# EasyEDA schematic SCH_5730 Compact_2022-07-11.json
TITLE: Sheet_1; REV: 1.0; Date: 2022-07-10; Sheet: 1/1; Drawn By: limchengwei; Company: Your Company
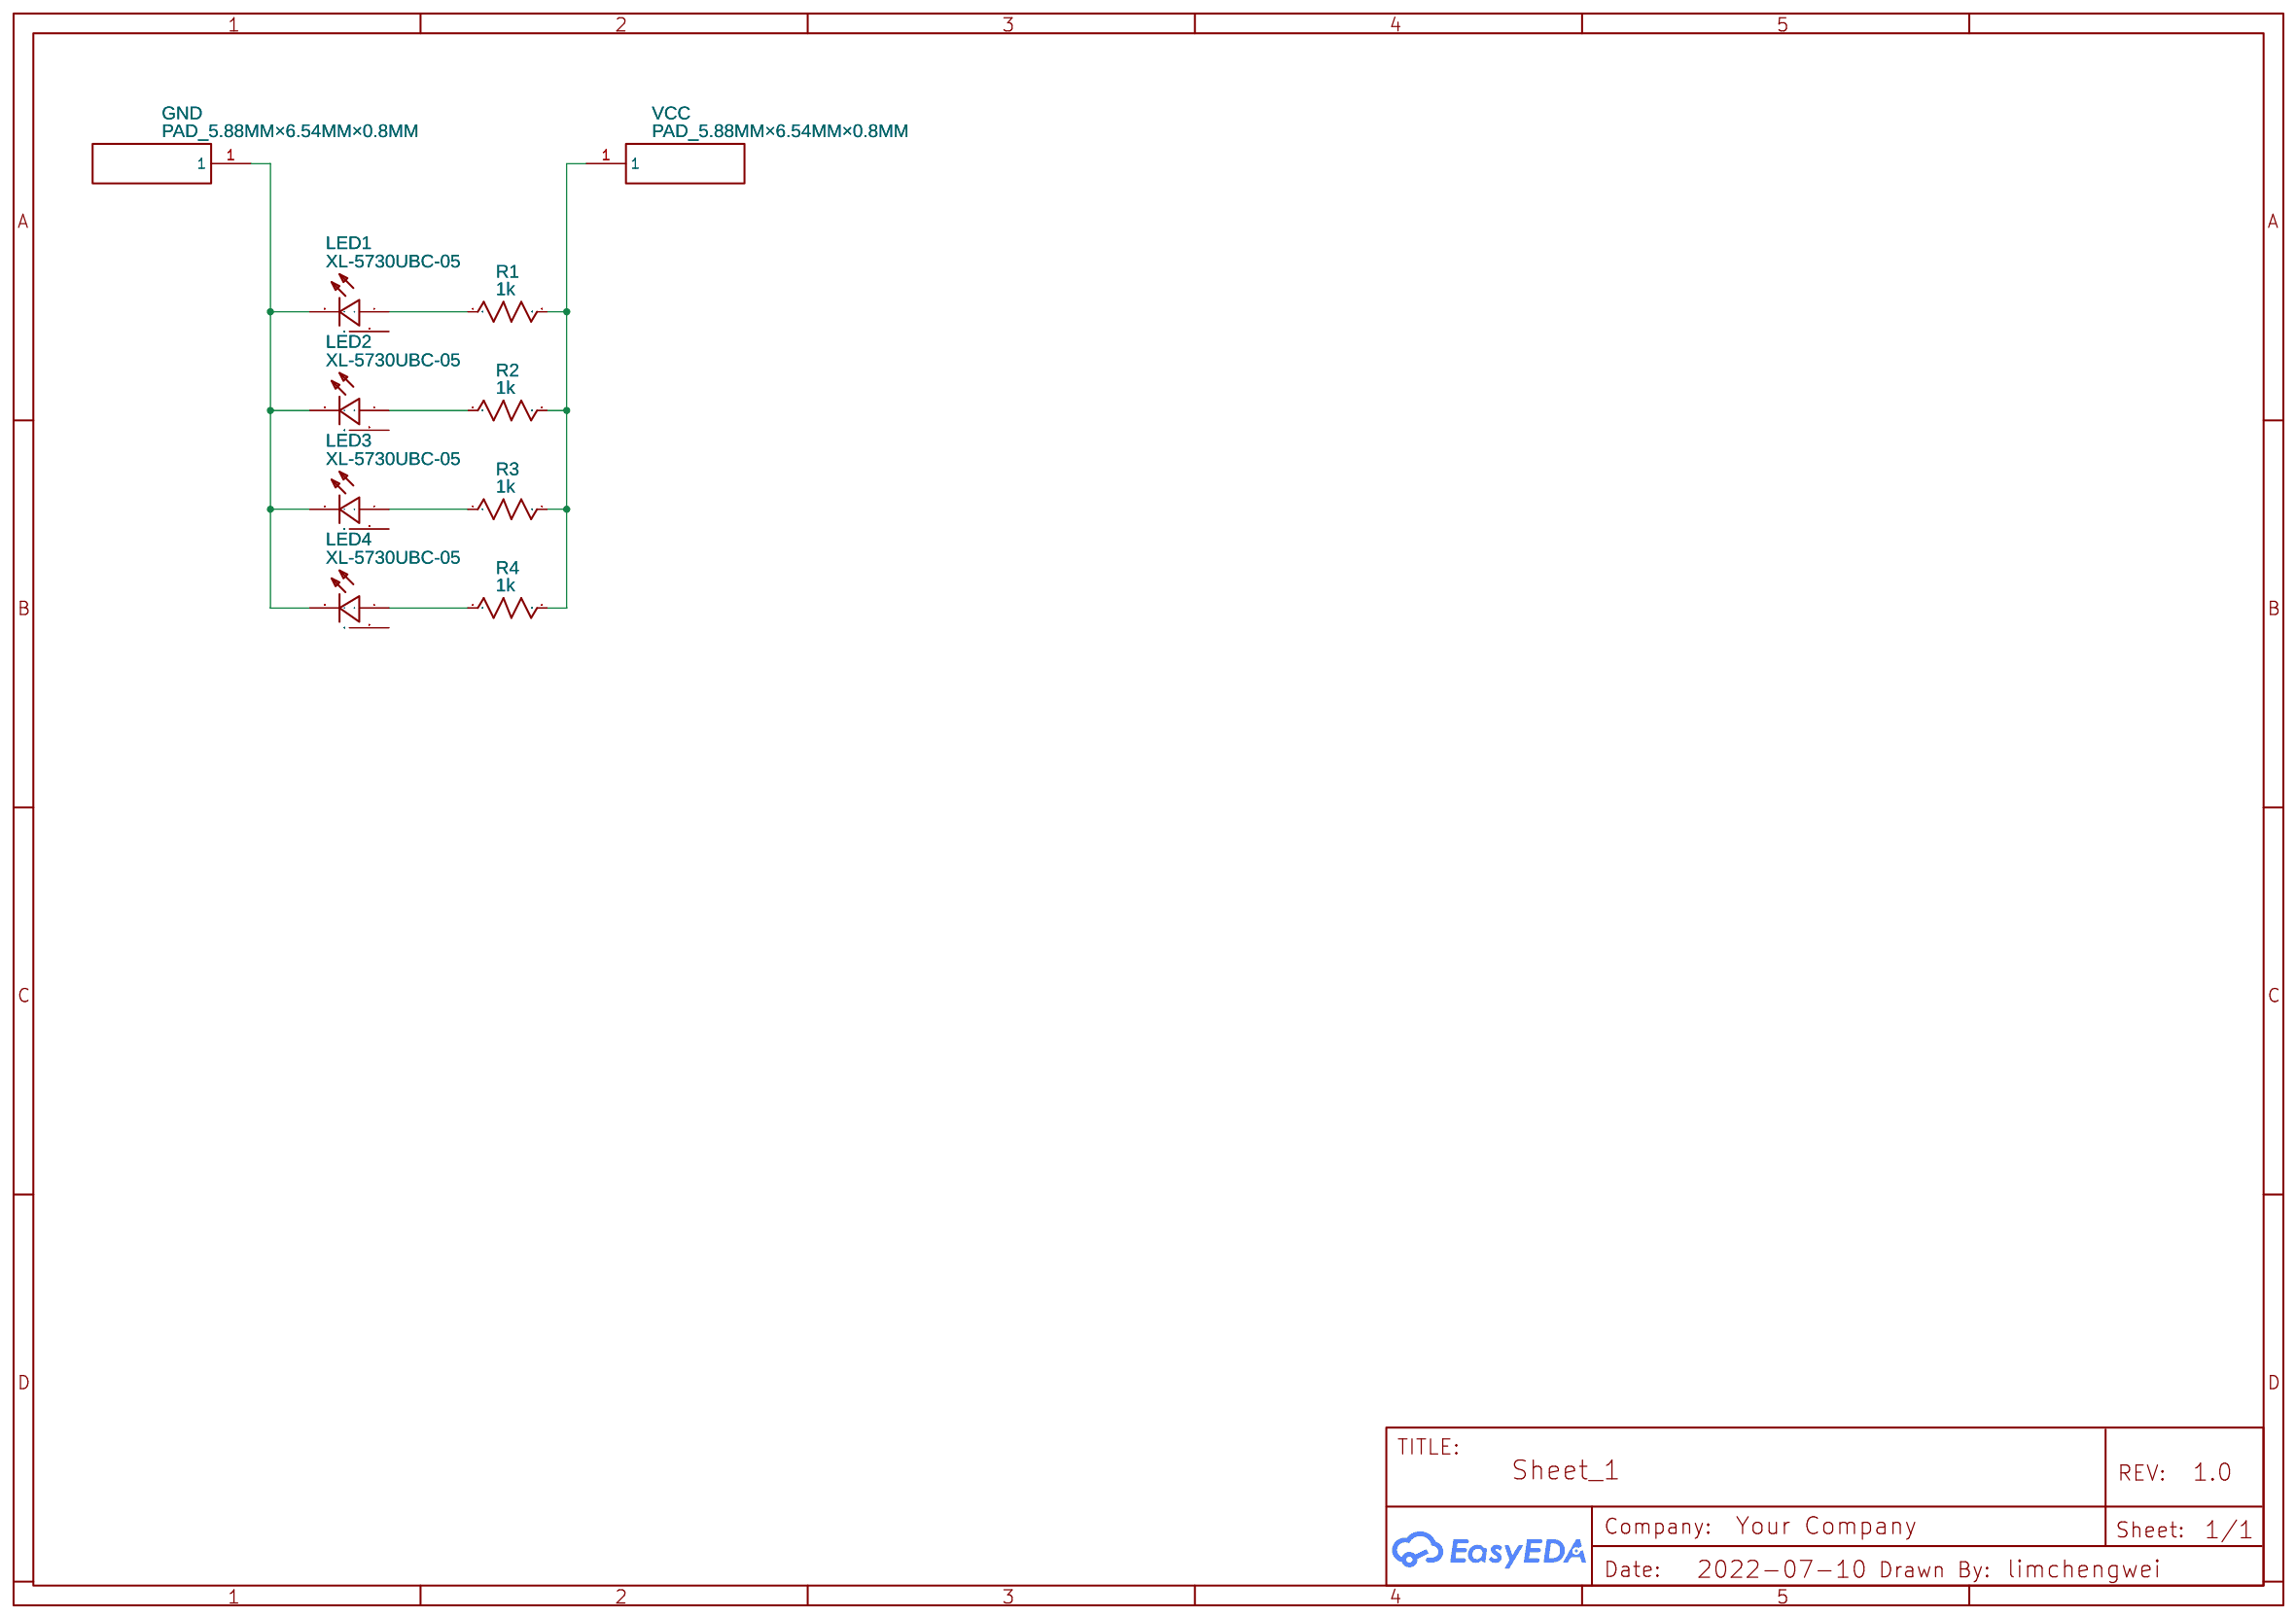
[diagram p0: schematic sheet]

## Parts
GND  PAD_5.88MM×6.54MM×0.8MM  [TESTPOINT-SMD_PAD_5.88MM-6.54MM-0.8MM]
LED1  XL-5730UBC-05  [LED-SMD_L5.7-W3.0-R-RD_BLUE]
LED2  XL-5730UBC-05  [LED-SMD_L5.7-W3.0-R-RD_BLUE]
LED3  XL-5730UBC-05  [LED-SMD_L5.7-W3.0-R-RD_BLUE]
LED4  XL-5730UBC-05  [LED-SMD_L5.7-W3.0-R-RD_BLUE]
R1  1k  [R1812]
R2  1k  [R1812]
R3  1k  [R1812]
R4  1k  [R1812]
VCC  PAD_5.88MM×6.54MM×0.8MM  [TESTPOINT-SMD_PAD_5.88MM-6.54MM-0.8MM]

## Library data of the parts
GND VCC = PAD_5.88MM×6.54MM×0.8MM: Supplier: LCSC; Supplier Part: C9900000336; Manufacturer: null; Manufacturer Part: PAD_5.88mm×6.54mm×0.8mm; JLCPCB Part Class: Extended Part; Contributor: LCSC
LED1-LED4 = XL-5730UBC-05: Supplier: LCSC; Supplier Part: C2843885; Manufacturer: XINGLIGHT(成兴光); Contributor: LCSC; JLCPCB Part Class: Extended Part
R1-R4 = R_1812_US: Contributor: LCEDA_Lib

## Nets
Net-(GND-1): GND.1 LED1.2(-) LED2.2(-) LED3.2(-) LED4.2(-)
Net-(LED1-1): LED1.1(+) R1.1
Net-(LED2-1): LED2.1(+) R2.1
Net-(LED3-1): LED3.1(+) R3.1
Net-(LED4-1): LED4.1(+) R4.1
Net-(R1-2): R1.2 R2.2 R3.2 R4.2 VCC.1

Not connected (* = marked no-connect by the designer): LED1 3; LED2 3; LED3 3; LED4 3
